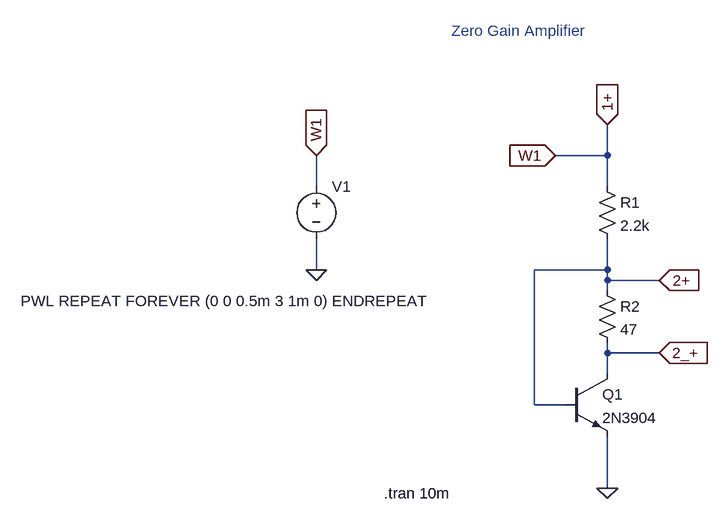
[diagram p0: schematic zero_gain_ltspice.asc]
zero_gain_ltspice.asc, the LTspice schematic file:
Version 4
SHEET 1 880 680
WIRE 208 -224 208 -272
WIRE 208 -224 128 -224
WIRE -240 -176 -240 -224
WIRE 208 -176 208 -224
WIRE -240 -48 -240 -96
WIRE 208 -48 208 -96
WIRE 208 -48 96 -48
WIRE 208 -32 208 -48
WIRE 288 -32 208 -32
WIRE 208 -16 208 -32
WIRE 208 80 208 64
WIRE 288 80 208 80
WIRE 208 112 208 80
WIRE 96 160 96 -48
WIRE 144 160 96 160
WIRE 208 288 208 208
FLAG 208 288 0
FLAG 128 -224 W1
IOPIN 128 -224 In
FLAG -240 -48 0
FLAG -240 -224 W1
IOPIN -240 -224 In
FLAG 208 -272 1+
IOPIN 208 -272 In
FLAG 288 -32 2+
IOPIN 288 -32 In
FLAG 288 80 2_+
IOPIN 288 80 In
SYMBOL npn 144 112 R0
SYMATTR InstName Q1
SYMATTR Value 2N3904
SYMBOL res 192 -192 R0
SYMATTR InstName R1
SYMATTR Value 2.2k
SYMBOL res 192 -32 R0
SYMATTR InstName R2
SYMATTR Value 47
SYMBOL voltage -240 -192 R0
WINDOW 3 -455 192 Left 2
WINDOW 123 0 0 Left 0
WINDOW 39 0 0 Left 0
SYMATTR Value PWL REPEAT FOREVER (0 0 0.5m 3 1m 0) ENDREPEAT
SYMATTR InstName V1
TEXT -136 296 Left 2 !.tran 10m
TEXT -32 -416 Left 2 ;Zero Gain Amplifier

The netlist it stands for:
* zero_gain_ltspice.asc
Q1 2_+ 2+ 0 0 2N3904
R1 1+ 2+ 2.2k
R2 2+ 2_+ 47
V1 1+ 0 PWL REPEAT FOREVER (0 0 0.5m 3 1m 0) ENDREPEAT
.model NPN NPN
.model PNP PNP
.lib standard.bjt
.tran 10m
* Zero Gain Amplifier
.backanno
.end